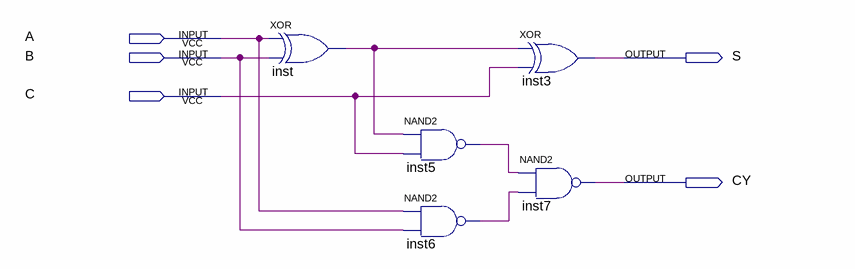
[diagram p0: schematic sheet]
// Quartus schematic Fulladd.bdf as structural Verilog: 5 symbols, 5 pins
module Fulladd (
  input  A,
  input  B,
  input  C,
  output S,
  output CY
);

  wire inst5_out, inst6_out, inst_out;

  xor inst (inst_out, A, B);
  nand inst5 (inst5_out, inst_out, C);
  nand inst6 (inst6_out, A, B);
  xor inst3 (S, inst_out, C);
  nand inst7 (CY, inst5_out, inst6_out);
endmodule
